# EasyEDA Pro project ProPrj_2026_05_12_drone_2026-05-23.epro

# Schematic Schematic1
Board Name: Board1; Create Date: 2026-05-12; Page Name: P1; Project Name: 2026_05_12_drone; Schematic Name: Schematic1; Update Date: 2026-05-12; Company: EasyEDA.com; Page Size: A4; Version: V1.0
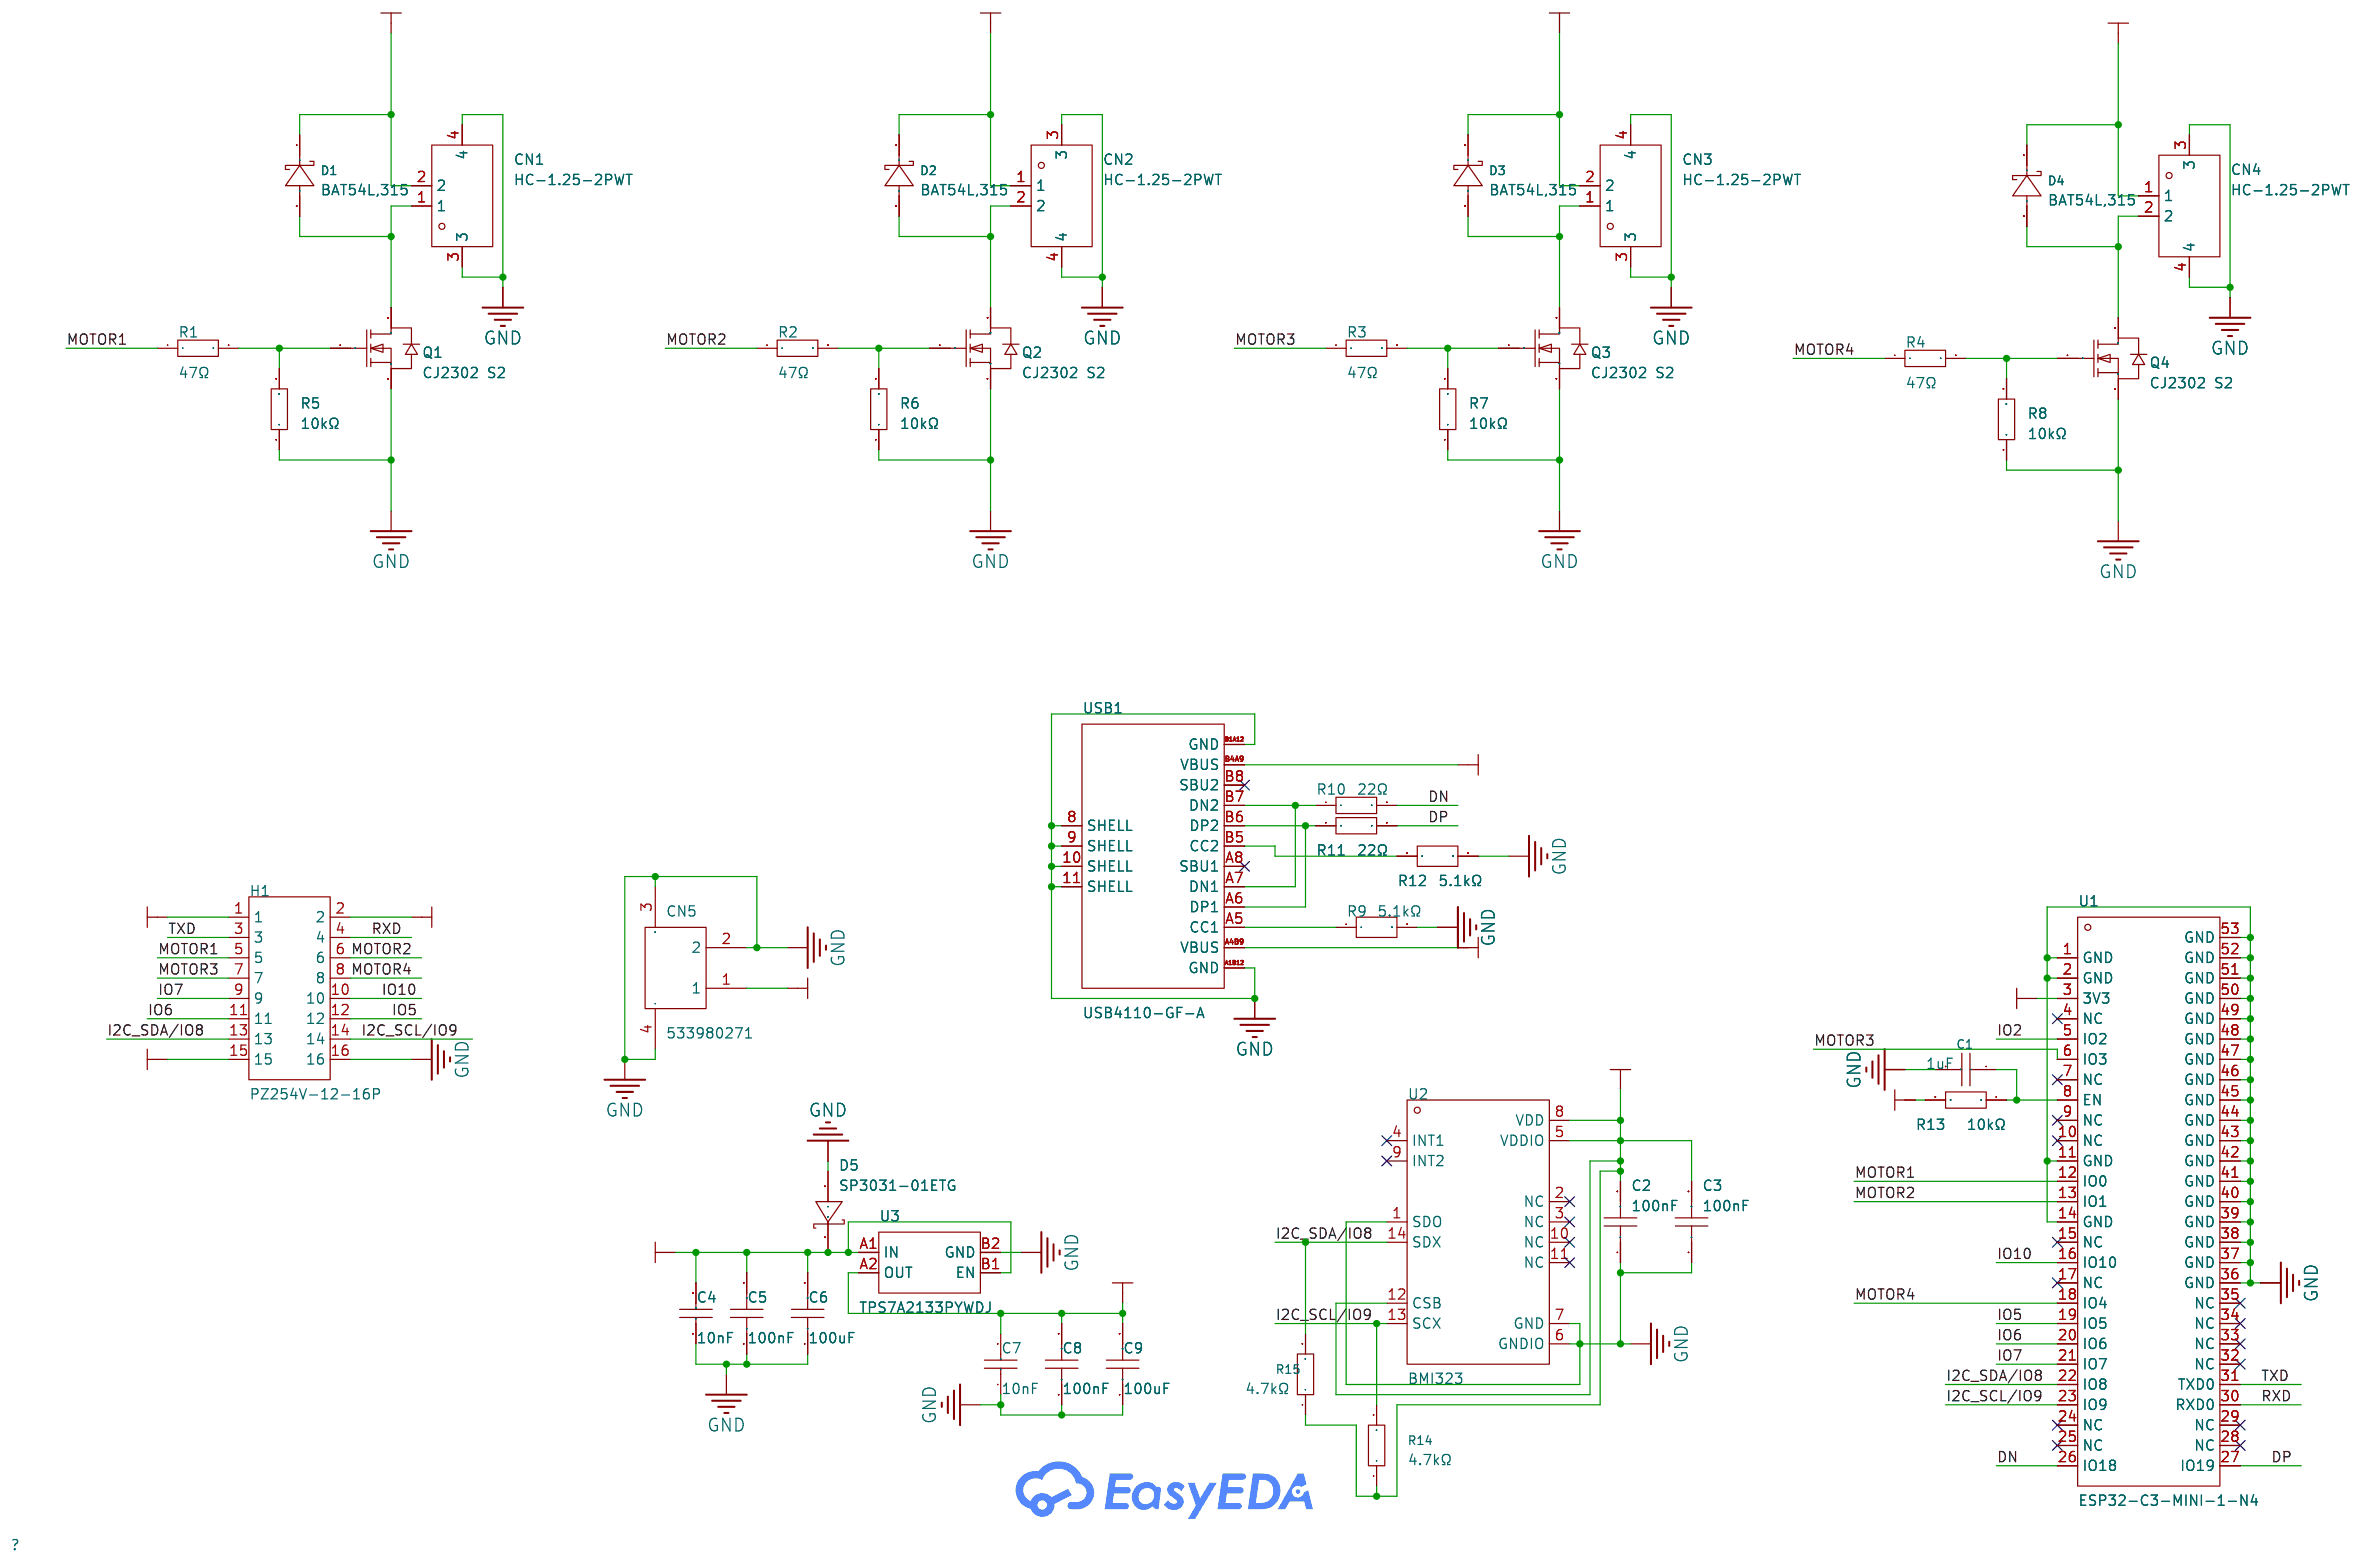
[diagram p0: schematic sheet]

## Parts
C1  1uF  [C0402]
C2  100nF  [C0402]
C3  100nF  [C0402]
C4  10nF  [C0402]
C5  100nF  [C0603]
C6  100uF  [C1206]
C7  10nF  [C0402]
C8  100nF  [C0603]
C9  100uF  [C1206]
CN1  HC-1.25-2PWT  [CONN-SMD_2P-P1.25-HC-1.25-2PWT]
CN2  HC-1.25-2PWT  [CONN-SMD_2P-P1.25-HC-1.25-2PWT]
CN3  HC-1.25-2PWT  [CONN-SMD_2P-P1.25-HC-1.25-2PWT]
CN4  HC-1.25-2PWT  [CONN-SMD_2P-P1.25-HC-1.25-2PWT]
CN5  533980271  [CONN-SMD_2P-P1.25_053398-0X71]
D1  BAT54L,315  [DFN1006-2L-RD]
D2  BAT54L,315  [DFN1006-2L-RD]
D3  BAT54L,315  [DFN1006-2L-RD]
D4  BAT54L,315  [DFN1006-2L-RD]
D5  SP3031-01ETG  [SOD-882_L1.0-W0.6-RD]
H1  PZ254V-12-16P  [HDR-TH_16P-P2.54-V-M-R2-C8-S2.54]
Q1  CJ2302 S2  [SOT-23-3_L3.0-W1.7-P0.95-LS2.9-BR]
Q2  CJ2302 S2  [SOT-23-3_L3.0-W1.7-P0.95-LS2.9-BR]
Q3  CJ2302 S2  [SOT-23-3_L3.0-W1.7-P0.95-LS2.9-BR]
Q4  CJ2302 S2  [SOT-23-3_L3.0-W1.7-P0.95-LS2.9-BR]
R1  47Ω  [R0402]
R2  47Ω  [R0402]
R3  47Ω  [R0402]
R4  47Ω  [R0402]
R5  10kΩ  [R0402]
R6  10kΩ  [R0402]
R7  10kΩ  [R0402]
R8  10kΩ  [R0402]
R9  5.1kΩ  [R0603]
R10  22Ω  [R0603]
R11  22Ω  [R0603]
R12  5.1kΩ  [R0603]
R13  10kΩ  [R0603]
R14  4.7kΩ  [R0402]
R15  4.7kΩ  [R0402]
U1  ESP32-C3-MINI-1-N4  [WIFIM-SMD_ESP32-C3-MINI-1]
U2  BMI323  [LGA-14_L3.0-W2.5-P0.50-TL_QMI8658A]
U3  TPS7A2133PYWDJ  [DSBGA-4_L0.6-W0.6-P0.35-TL]
USB1  USB4110-GF-A  [USB-C-SMD_TYPE-C-16P-USB4110-GF-A]

## Library data of the parts
C1 = CL05A105KO5NNNC: Capacitance:1uF Tolerance:±10% Tolerance:±10% Voltage Rating:16V Temperature Coefficient:X5R; LCSC Part Name: 1uF ±10% 16V; Supplier Part: C29266; Manufacturer: SAMSUNG(三星); Supplier Footprint: 0402; JLCPCB Part Class: Extended Part; Datasheet: https://item.szlcsc.com/datasheet/CL05A105KO5NNNC/30018.html; Supplier: LCSC; Tolerance: ±10%; Voltage Rating: 16V; Temperature Coefficient: X5R
C2 C3 = CL05B104KO5NNNC: Capacitance: Tolerance:±10% Tolerance:±10% Voltage Rated: Temperature Coefficient:; LCSC Part Name: 100nF ±10% 16V; Supplier Part: C1525; Manufacturer: SAMSUNG(三星); Supplier Footprint: 0402; JLCPCB Part Class: Basic Part; Datasheet: https://atta.szlcsc.com/upload/public/pdf/source/20160218/1457707763339.pdf; Supplier: LCSC; Tolerance: ±10%
C4 C7 = CL05B103KB5NNNC: Capacitance:10nF Tolerance:±10% Tolerance:±10% Voltage Rating:50V Temperature Coefficient:X7R; LCSC Part Name: 10nF ±10% 50V; Supplier Part: C15195; Manufacturer: SAMSUNG(三星); Supplier Footprint: 0402; JLCPCB Part Class: Basic Part; Datasheet: https://item.szlcsc.com/datasheet/CL05B103KB5NNNC/15869.html; Supplier: LCSC; Tolerance: ±10%; Voltage Rating: 50V; Temperature Coefficient: X7R
C5 C8 = CC0603KRX7R9BB104: Capacitance:100nF Tolerance:±10% Tolerance:±10% Voltage Rating:50V Temperature Coefficient:X7R; LCSC Part Name: 100nF ±10% 50V; Supplier Part: C14663; Manufacturer: YAGEO(国巨); Supplier Footprint: 0603; Datasheet: https://item.szlcsc.com/datasheet/CC0603KRX7R9BB104/15331.html; Supplier: LCSC; Tolerance: ±10%; Voltage Rating: 50V; Temperature Coefficient: X7R
C6 C9 = HGC1206R5107M100NSPJ: Capacitance:100uF Tolerance:±20% Tolerance:±20% Voltage Rating:10V Temperature Coefficient:X5R; LCSC Part Name: 100uF ±20% 10V; Supplier Part: C7432784; Manufacturer: Chinocera(华瓷); Supplier Footprint: 1206; JLCPCB Part Class: Extended Part; Datasheet: https://atta.szlcsc.com/upload/public/pdf/source/20240320/FAC3FEC40A78BC5CCCE96C232A94D860.pdf; Supplier: LCSC; Tolerance: ±20%; Voltage Rating: 10V; Temperature Coefficient: X5R
CN1-CN4 = HC-1.25-2PWT: Pins Structure:1x2P Pitch:1.25mm Mounting Style:Horizontal attachment Reference Series:PicoBlade(MX 1.25) Number of Pins:2P Number of Rows:1 Number of PINs Per Row:2 Row Spacing:- Current Rating (Max):1A Contact Material:Brass Contact Plating:Tin Operatin; LCSC Part Name: 1x2P 间距:1.25mm 卧贴 系列:PicoBlade(MX 1.25); Supplier Part: C2845379; Manufacturer: HCTL(华灿天禄); Supplier Footprint: SMD,P=1.25mm,卧贴; JLCPCB Part Class: Extended Part; Datasheet: https://atta.szlcsc.com/upload/public/pdf/source/20240930/9508A8292CCC87B0C29E3A028D56E30A.pdf; Supplier: LCSC; Pins Structure: 1x2P; Pitch: 1.25mm; Mounting Style: Horizontal attachment; Reference Series: PicoBlade(MX 1.25); Number of Pins: 2P; Number of Rows: 1; Number of PINs Per Row: 2; Current Rating (Max): 1A; Contact Material: Brass; Contact Plating: Tin; Operating Temperature Range: -40℃~+105℃; Rated Voltage (Max): 125V; Plastic Material: LCP; Flame Retardant Rating: UL94V-0; Supplementary Features: Auxiliary soldering legs; Z-Height of the Board: 3.57mm; X-Length of Bottom Edge on Board (Spacing Line): 7.55mm; Y-Width of Bottom Edge on Board: 5.25mm
CN5 = 533980271_C122410: Pins Structure:1x2P Pitch:1.25mm Mounting Type:Surface Mount,Vertical Reference Series:PicoBlade(MX 1.25) Number of Pins:2P Number of Rows:1 Number of PINs Per Row:2 Row Spacing:- Current Rating:1A Contact Material:Phosphor Bronze Contact Plating:Tin Oper; LCSC Part Name: 1x2P 间距:1.25mm 立贴 系列:PicoBlade(MX 1.25); Supplier Part: C122410; Manufacturer: MOLEX; Supplier Footprint: SMD,P=1.25mm; JLCPCB Part Class: Extended Part; Datasheet: https://www.molex.com/content/dam/molex/molex-dot-com/products/automated/en-us/salesdrawingpdf/533/53398/533980271_sd.pdf?inline; Supplier: LCSC; Pins Structure: 1x2P; Pitch: 1.25mm; Mounting Type: Surface Mount,Vertical; Reference Series: PicoBlade(MX 1.25); Number of Pins: 2P; Number of Rows: 1; Number of PINs Per Row: 2; Current Rating: 1A; Contact Material: Phosphor Bronze; Contact Plating: Tin; Operating Temperature: -40℃~+105℃; Voltage Rating: 125V; Plastic Material: Glass-Fiber Reinforced PA; Flame Retardant Rating: UL94V-0; Supplementary Features: Auxiliary Solder Pin; Color: White; Z-Height of the Board: 4.7mm; X-Length of Bottom Edge on Board (Spacing Line): 7.65mm; Y-Width of Bottom Edge on Board: 4.2mm
D1-D4 = BAT54L,315: Voltage - Forward(Vf@If):800mV@100mA Voltage - DC Reverse(Vr):30V Current - Rectified:200mA Reverse Leakage Current (Ir):2uA@25V Non-Repetitive Peak Forward Surge Current:600mA; LCSC Part Name: 电压:30V 电流:200mA; Supplier Part: C549279; Manufacturer: Nexperia(安世); Supplier Footprint: DFN1006-2; JLCPCB Part Class: Extended Part; Datasheet: https://item.szlcsc.com/datasheet/BAT54L%252C315/570347.html; Supplier: LCSC; Voltage - Forward(Vf@If): 800mV@100mA; Voltage - DC Reverse(Vr): 30V; Current - Rectified: 200mA; Reverse Leakage Current (Ir): 2uA@25V; Non-Repetitive Peak Forward Surge Current: 600mA
D5 = SP3031-01ETG: Polarity:Unidirectional Reverse Stand-Off Voltage (Vrwm):5V Clamping Voltage:7.5V Peak Pulse Current (Ipp):5A@8/20us Peak Pulse Power Dissipation (Ppp):- Voltage - Breakdown:6V Reverse Leakage Current (Ir):1uA Number of Channels:1.0 level of protection:IE; Supplier Part: C207283; Manufacturer: Littelfuse(美国力特); Supplier Footprint: SOD-882; JLCPCB Part Class: Extended Part; Datasheet: https://item.szlcsc.com/datasheet/SP3031-01ETG/208402.html; Supplier: LCSC; Polarity: Unidirectional; Reverse Stand-Off Voltage (Vrwm): 5V; Clamping Voltage: 7.5V; Peak Pulse Current (Ipp): 5A@8/20us; Voltage - Breakdown: 6V; Reverse Leakage Current (Ir): 1uA; Number of Channels: 1.0; level of protection: IEC 61000-4-4；IEC 61000-4-5；IEC 61000-4-2; Type: TVS; Junction Capacitance: 0.8pF
H1 = PZ254V-12-16P: Pin Structure:2x8P Pitch:2.54mm Row Spacing:2.54mm Circluar Pins/Square Pins:Pin Header Mounting Type:Through Hole Number of Rows:2 Number of Pins:16P Current Rating:- Voltage Rating (Max):- Length of Mating Pin:6mm Insulation Height:2.5mm Length of End C; LCSC Part Name: 2x8P 间距:2.54mm 方针 直插; Supplier Part: C492425; Manufacturer: XFCN(兴飞); Supplier Footprint: 插件,P=2.54mm; JLCPCB Part Class: Extended Part; Datasheet: https://item.szlcsc.com/datasheet/PZ254V-12-16P/502981.html; Supplier: LCSC; Pin Structure: 2x8P; Pitch: 2.54mm; Row Spacing: 2.54mm; Circluar Pins/Square Pins: Pin Header; Mounting Type: Through Hole; Number of Rows: 2; Number of Pins: 16P; Length of Mating Pin: 6mm; Insulation Height: 2.5mm; Length of End Connection Pin: 3mm; Contact Material: Brass; Operating Temperature: -40℃~+105℃; Color: Black
Q1-Q4 = CJ2302 S2: Type:1 N-Channel Drain Source Voltage (Vdss): Continuous Drain Current (Id): Drain Source On Resistance (RDS(on)@Vgs,Id):0.115Ω@2.5V,3.1A Power Dissipation (Pd):350mW Gate Threshold Voltage (Vgs(th)@Id):1.2V@50uA Total Gate Charge (Qg@Vgs):10nC@4.5V Input; LCSC Part Name: 1个N沟道 耐压:20V 电流:2.1A; Supplier Part: C8548; Manufacturer: CJ(江苏长电/长晶); Supplier Footprint: SOT-23; JLCPCB Part Class: Extended Part; Datasheet: https://atta.szlcsc.com/upload/public/pdf/source/20130613/1457706609595.pdf; Supplier: LCSC; Type: 1 N-Channel; Drain Source On Resistance (RDS(on)@Vgs,Id): 0.115Ω@2.5V,3.1A; Power Dissipation (Pd): 350mW; Gate Threshold Voltage (Vgs(th)@Id): 1.2V@50uA; Total Gate Charge (Qg@Vgs): 10nC@4.5V; Input Capacitance (Ciss@Vds): 300pF@10V; Reverse Transfer Capacitance (Crss@Vds): 80pF@10V; Operating Temperature: -55℃~+150℃
R1-R4 = RC0402FR-0747RL: Type:Thick Film Resistor Resistance:47Ω Tolerance:±1% Tolerance:±1% Power(Watts):62.5mW Voltage-Supply(Max):50V Temperature Coefficient:±100ppm/℃ Temperature Coefficient:±100ppm/℃ Operating Temperature:-55℃~+155℃ Operating Temperature:-55℃~+155℃; LCSC Part Name: 厚膜电阻 47Ω ±1% 62.5mW; Supplier Part: C137973; Manufacturer: YAGEO(国巨); Supplier Footprint: 0402; Datasheet: https://item.szlcsc.com/datasheet/RC0402FR-0747RL/149289.html; Supplier: LCSC; Type: Thick Film Resistor; Tolerance: ±1%; Power(Watts): 62.5mW; Voltage-Supply(Max): 50V; Temperature Coefficient: ±100ppm/℃; Operating Temperature: -55℃~+155℃
R5-R8 = RC0402FR-0710KL: Type:Thick Film Resistor Resistance:10kΩ Tolerance:±1% Tolerance:±1% Power(Watts):62.5mW Voltage-Supply(Max):50V Temperature Coefficient:±100ppm/℃ Temperature Coefficient:±100ppm/℃ Operating Temperature:-55℃~+155℃ Operating Temperature:-55℃~+155℃; LCSC Part Name: 厚膜电阻 10kΩ ±1% 62.5mW; Supplier Part: C60490; Manufacturer: YAGEO(国巨); Supplier Footprint: 0402; Datasheet: https://item.szlcsc.com/datasheet/RC0402FR-0710KL/61542.html; Supplier: LCSC; Type: Thick Film Resistor; Tolerance: ±1%; Power(Watts): 62.5mW; Voltage-Supply(Max): 50V; Temperature Coefficient: ±100ppm/℃; Operating Temperature: -55℃~+155℃
R9 R12 = FRC0603F5101TS: Type:Thick Film Resistor Resistance:5.1kΩ Tolerance:±1% Tolerance:±1% Power(Watts):100mW Voltage-Supply(Max):75V Temperature Coefficient:±100ppm/℃ Temperature Coefficient:±100ppm/℃ Operating Temperature:-55℃~+155℃ Operating Temperature:-55℃~+155℃; LCSC Part Name: 5.1kΩ ±1% 100mW 厚膜电阻; Supplier Part: C2907044; Manufacturer: FOJAN(富捷); Supplier Footprint: 0603; JLCPCB Part Class: Extended Part; Supplier: LCSC; Type: Thick Film Resistor; Tolerance: ±1%; Power(Watts): 100mW; Voltage-Supply(Max): 75V; Temperature Coefficient: ±100ppm/℃; Operating Temperature: -55℃~+155℃
R10 R11 = 0603WAF220JT5E: Type:Thick Film Resistors Resistance:22Ω Tolerance:±1% Tolerance:±1% Power(Watts): Overload Voltage (Max): Temperature Coefficient:±100ppm/℃ Temperature Coefficient:±100ppm/℃ Operating Temperature Range:-55℃~+155℃ Operating Temperature Range:-55℃~+155℃; LCSC Part Name: 22Ω ±1% 100mW 厚膜电阻; Supplier Part: C23345; Manufacturer: UNI-ROYAL(厚声); Supplier Footprint: 0603; JLCPCB Part Class: Basic Part; Datasheet: https://atta.szlcsc.com/upload/public/pdf/source/20200306/C422600_1E6D84923E4A46A82E41ADD87F860B5C.pdf; Supplier: LCSC; Type: Thick Film Resistors; Tolerance: ±1%; Temperature Coefficient: ±100ppm/℃; Operating Temperature Range: -55℃~+155℃
R13 = RC0603FR-0710KL: Type:Thick Film Resistors Resistance: Tolerance:±1% Tolerance:±1% Power(Watts): Overload Voltage (Max): Temperature Coefficient:±100ppm/℃ Temperature Coefficient:±100ppm/℃ Operating Temperature Range:-55℃~+155℃ Operating Temperature Range:-55℃~+155℃; LCSC Part Name: 厚膜电阻 10kΩ ±1% 100mW; Supplier Part: C98220; Manufacturer: YAGEO(国巨); Supplier Footprint: 0603; JLCPCB Part Class: Extended Part; Datasheet: https://atta.szlcsc.com/upload/public/pdf/source/20180927/C295883_E8D83085EA81BD7DE0B2B681138C15EE.pdf; Supplier: LCSC; Type: Thick Film Resistors; Tolerance: ±1%; Temperature Coefficient: ±100ppm/℃; Operating Temperature Range: -55℃~+155℃
R14 R15 = 0402WGF4701TCE: Type:Thick Film Resistor Resistance:4.7kΩ Tolerance:±1% Tolerance:±1% Power(Watts):62.5mW Voltage-Supply(Max):50V Temperature Coefficient:±100ppm/℃ Temperature Coefficient:±100ppm/℃ Operating Temperature:-55℃~+155℃ Operating Temperature:-55℃~+155℃; LCSC Part Name: 4.7kΩ ±1% 62.5mW 厚膜电阻; Supplier Part: C25900; Manufacturer: UNI-ROYAL(厚声); Supplier Footprint: 0402; JLCPCB Part Class: Basic Part; Datasheet: https://item.szlcsc.com/datasheet/0402WGF4701TCE/26643.html; Supplier: LCSC; Type: Thick Film Resistor; Tolerance: ±1%; Power(Watts): 62.5mW; Voltage-Supply(Max): 50V; Temperature Coefficient: ±100ppm/℃; Operating Temperature: -55℃~+155℃
U1 = ESP32-C3-MINI-1-N4: Supplier Part: C2838502; Manufacturer: ESPRESSIF(乐鑫); Supplier Footprint: SMD,13.2x16.6mm; JLCPCB Part Class: Extended Part; Datasheet: https://item.szlcsc.com/datasheet/ESP32-C3-MINI-1-N4/3013227.html; Supplier: LCSC
U2 = BMI323: Sensor Type:Accelerometer Gyroscope Operating Temperature:-40℃~+85℃ Operating Temperature:-40℃~+85℃; LCSC Part Name: 小型多功能惯性测量单元; Supplier Part: C5368700; Manufacturer: Bosch(博世); Supplier Footprint: LGA-14; JLCPCB Part Class: Extended Part; Datasheet: https://item.szlcsc.com/datasheet/BMI323/6208337.html; Supplier: LCSC; Sensor Type: Accelerometer Gyroscope; Operating Temperature: -40℃~+85℃
U3 = TPS7A2133PYWDJ: Output Type:Fixed Maximum Input Voltage:6V Output Voltage:3.3V Output Voltage:3.3V Output Current:500mA Power Supply Rejection Ratio (PSRR):61dB@(100Hz) Operating Temperature:-40℃~+125℃@(Tj) Operating Temperature:-40℃~+125℃@(Tj) Output Polarity:Positive e; LCSC Part Name: 500mA 低噪声、低 IQ、高 PSRR 低压降 (LDO) 稳压器; Supplier Part: C3019997; Manufacturer: TI(德州仪器); Supplier Footprint: DSBGA-4; JLCPCB Part Class: Extended Part; Datasheet: https://www.ti.com/cn/lit/gpn/tps7a21; Supplier: LCSC; Output Type: Fixed; Maximum Input Voltage: 6V; Output Voltage: 3.3V; Output Current: 500mA; Power Supply Rejection Ratio (PSRR): 61dB@(100Hz); Operating Temperature: -40℃~+125℃@(Tj); Output Polarity: Positive electrode; Number of Outputs: 1
USB1 = USB4110-GF-A: Supplier Part: C5143397; Manufacturer: GCT; Supplier Footprint: SMD; JLCPCB Part Class: Extended Part; Datasheet: https://item.szlcsc.com/datasheet/USB4110-GF-A/5762033.html; Supplier: LCSC

## Nets
3V3: C2.2 C3.2 C7.2 C8.2 C9.2 H1.15 R13.2 R14.1 R15.1 U1.3(3V3) U2.5(VDDIO) U2.8(VDD) U2.12(CSB) U3.A2(OUT)
GND: C1.2 C2.1 C3.1 C4.1 C5.1 C6.1 C7.1 C8.1 C9.1 CN1.3 CN1.4 CN2.3 CN2.4 CN3.3 CN3.4 CN4.3 CN4.4 CN5.2 CN5.3 CN5.4 D5.2(A) H1.16 Q1.2(S) Q2.2(S) Q3.2(S) Q4.2(S) R5.1 R6.1 R7.1 R8.1 R9.2 R12.2 U1.1(GND) U1.2(GND) U1.11(GND) U1.14(GND) U1.36(GND) U1.37(GND) U1.38(GND) U1.39(GND) U1.40(GND) U1.41(GND) U1.42(GND) U1.43(GND) U1.44(GND) U1.45(GND) U1.46(GND) U1.47(GND) U1.48(GND) U1.49(GND) U1.50(GND) U1.51(GND) U1.52(GND) U1.53(GND) U2.1(SDO) U2.6(GNDIO) U2.7(GND) U3.B2(GND) USB1.8(SHELL) USB1.9(SHELL) USB1.10(SHELL) USB1.11(SHELL) USB1.A1B12(GND) USB1.B1A12(GND)
VBAT: CN1.2 CN2.1 CN3.2 CN4.1 CN5.1 D1.1(K) D2.1(K) D3.1(K) D4.1(K) H1.1
VCC: C4.2 C5.2 C6.2 D5.1(K) H1.2 U3.A1(IN) U3.B1(EN) USB1.A4B9(VBUS) USB1.B4A9(VBUS)
DN: R10.2 U1.26(IO18)
DP: R11.2 U1.27(IO19)
I2C_SCL/IO9: H1.14 R14.2 U1.23(IO9) U2.13(SCX)
I2C_SDA/IO8: H1.13 R15.2 U1.22(IO8) U2.14(SDX)
IO2: U1.5(IO2)
IO5: H1.12 U1.19(IO5)
IO6: H1.11 U1.20(IO6)
IO7: H1.9 U1.21(IO7)
IO10: H1.10 U1.16(IO10)
MOTOR1: H1.5 R1.1 U1.12(IO0)
MOTOR2: H1.6 R2.1 U1.13(IO1)
MOTOR3: H1.7 R3.1 U1.6(IO3)
MOTOR4: H1.8 R4.1 U1.18(IO4)
RXD: H1.4 U1.30(RXD0)
TXD: H1.3 U1.31(TXD0)
$1N2473: Q1.1(G) R1.2 R5.2
$1N2475: CN1.1 D1.2(A) Q1.3(D)
$1N2480: Q2.1(G) R2.2 R6.2
$1N2482: CN2.2 D2.2(A) Q2.3(D)
$1N2487: Q3.1(G) R3.2 R7.2
$1N2489: CN3.1 D3.2(A) Q3.3(D)
$1N2494: Q4.1(G) R4.2 R8.2
$1N2496: CN4.2 D4.2(A) Q4.3(D)
$1N2513: R9.1 USB1.A5(CC1)
$1N2515: R10.1 USB1.A7(DN1) USB1.B7(DN2)
$1N2516: R11.1 USB1.A6(DP1) USB1.B6(DP2)
$1N2522: R12.1 USB1.B5(CC2)
$1N2536: C1.1 R13.1 U1.8(EN)

Not connected (* = marked no-connect by the designer): U1 4(NC)* 7(NC)* 9(NC)* 10(NC)* 15(NC)* 17(NC)* 24(NC)* 25(NC)* 28(NC)* 29(NC)* 32(NC)* 33(NC)* 34(NC)* 35(NC)*; U2 2(NC)* 3(NC)* 4(INT1)* 9(INT2)* 10(NC)* 11(NC)*; USB1 A8(SBU1)* B8(SBU2)*

# Board PCB1
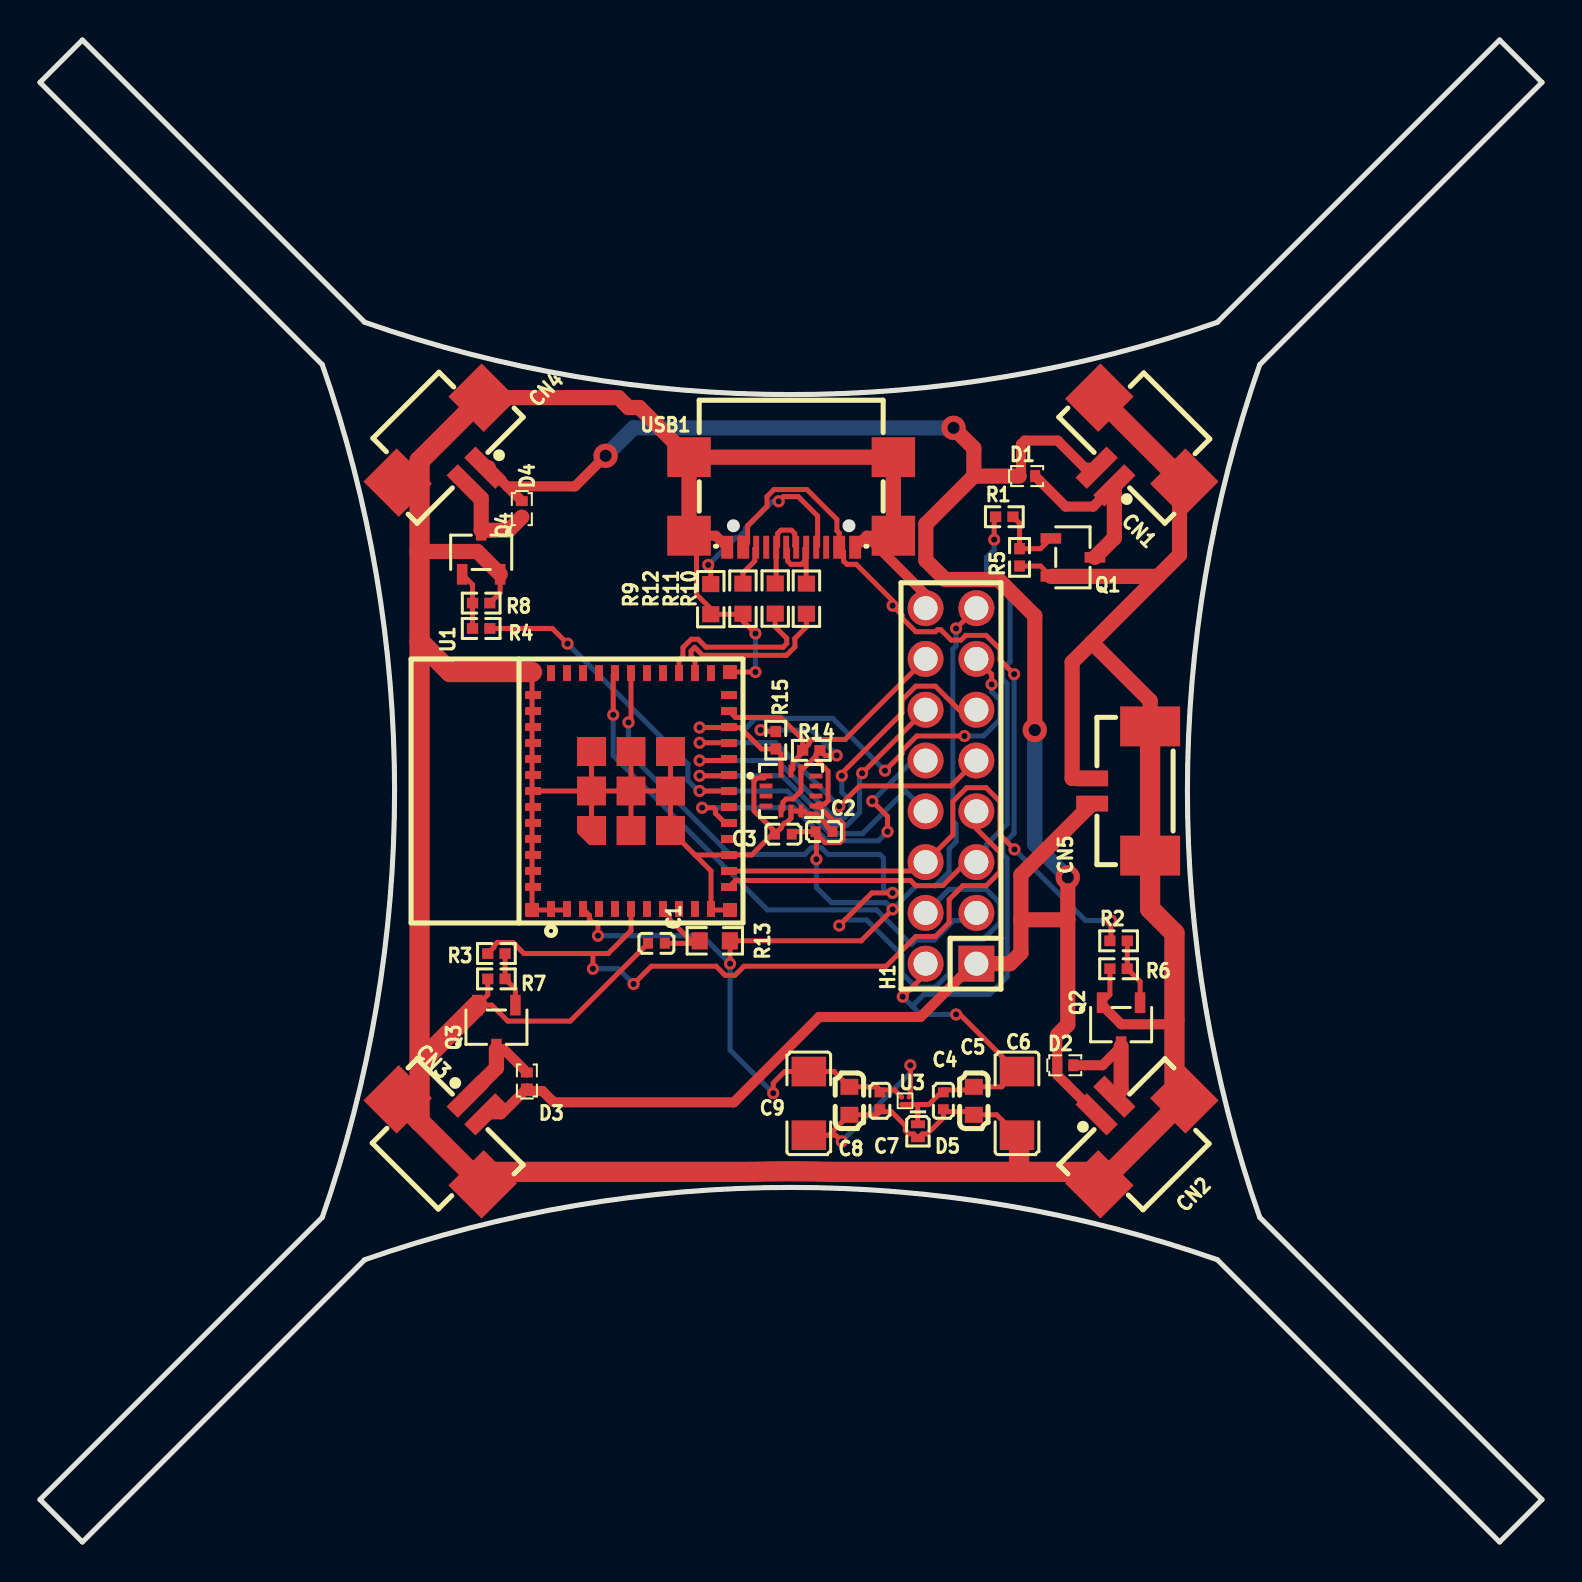
[diagram p1: board, top side]
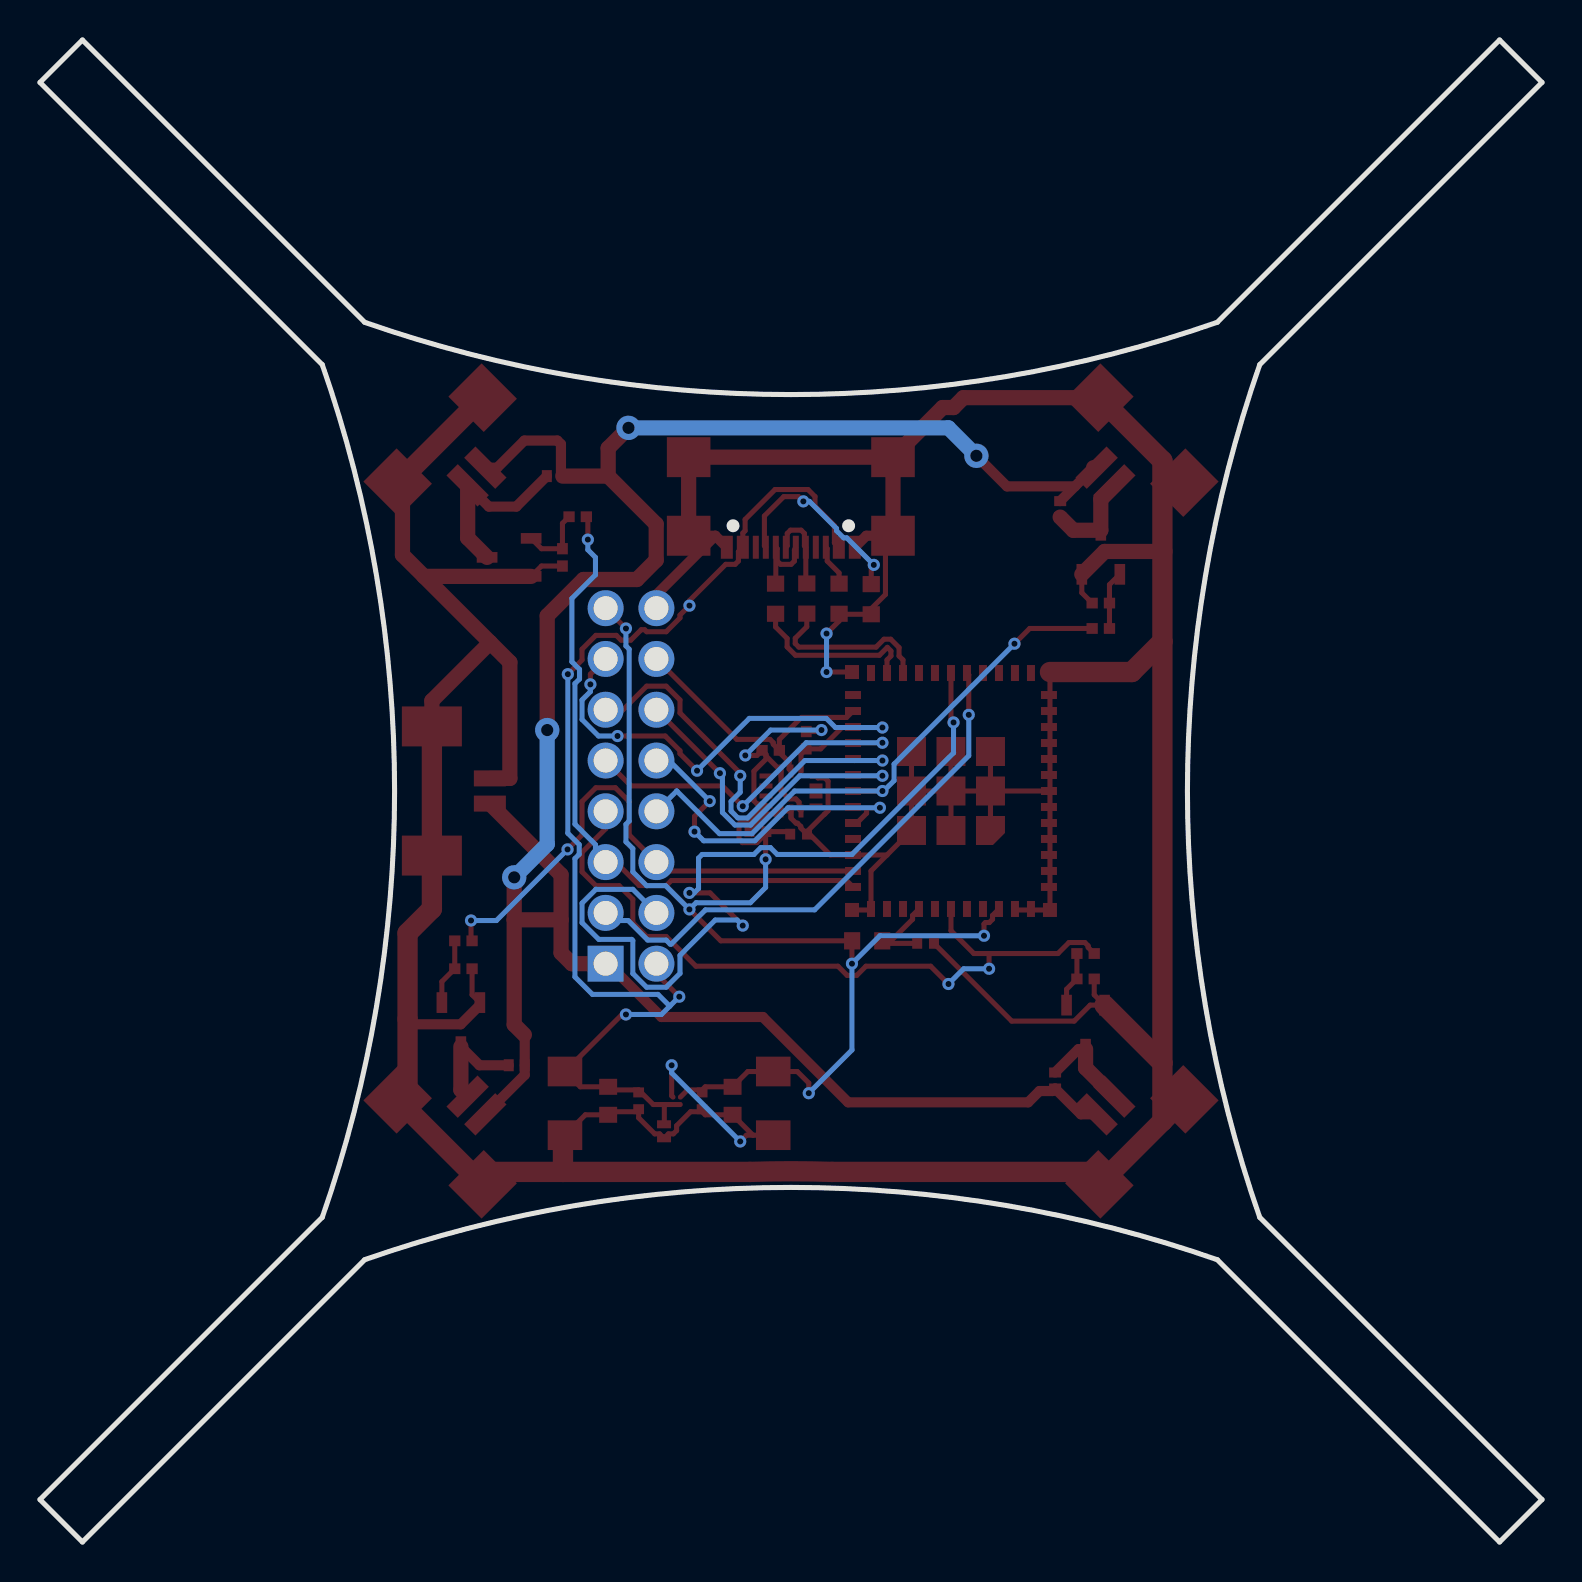
[diagram p2: board, bottom side, seen from below]

Outline 75.12 x 75.12 mm; copper layers: Top Layer, Bottom Layer. Coordinates in mm from the lower left corner of the outline.
Outline path: 0,73 2.12,75.12 16.24,61 arc(37.56,57.38) 58.88,61 73,75.12 75.12,73 61,58.88 arc(57.38,37.56) 61,16.24 75.12,2.12 73,0 58.88,14.12 arc(37.56,17.73) 16.24,14.12 2.12,0 0,2.12 14.12,16.24 arc(17.73,37.56) 14.12,58.88 0,73
Stack: Top Layer 0.035mm / Dielectric1 1.51mm FR4 er 4.5 / Bottom Layer 0.035mm

## Design rules (mm)
net DP: DP1
net DN: DP1
net $1N2515: DP2
net $1N2516: DP2
template: JLCPCB Capability(Two Layers Board)
spacing copperThickness1oz (default): track to track 0.102, other pairs 0.152 to 0.3
spacing copperThickness2oz: track to track 0.203, other pairs 0.152 to 0.3
track width copperThickness1oz (default): min 0.127, default 0.254, max 2.54
track width copperThickness2oz: min 0.203, default 0.254, max 2.54
differential pair differentialPair (default): width min 0.127, default 0.254, max 2.54; gap min 0.152, default 0.152
via viaSize (default): diameter min 0.5, default 0.61, max 10; hole min 0.3, default 0.305, max 6.3

## Placement (name value [footprint] x y rotation side)
C1  1uF  [C0402]  30.83 29.94 180 top
C2  100nF  [C0402]  39.21 35.53 180 top
C3  100nF  [C0402]  37.18 35.4 0 top
C4  10nF  [C0402]  45.18 22.06 90 top
C5  100nF  [C0603]  46.7 22.06 90 top
C6  100uF  [C1206]  48.86 21.94 90 top
C7  10nF  [C0402]  42 22.06 90 top
C8  100nF  [C0603]  40.48 22.06 90 top
C9  100uF  [C1206]  38.45 21.94 90 top
CN1  HC-1.25-2PWT  [CONN-SMD_2P-P1.25-HC-1.25-2PWT]  54.2 54.2 135 top
CN2  HC-1.25-2PWT  [CONN-SMD_2P-P1.25-HC-1.25-2PWT]  54.2 20.92 45 top
CN3  HC-1.25-2PWT  [CONN-SMD_2P-P1.25-HC-1.25-2PWT]  20.92 20.92 315 top
CN4  HC-1.25-2PWT  [CONN-SMD_2P-P1.25-HC-1.25-2PWT]  20.92 54.2 225 top
CN5  533980271  [CONN-SMD_2P-P1.25_053398-0X71]  54.07 37.56 90 top
D1  BAT54L,315  [DFN1006-2L-RD]  49.37 53.31 0 top
D2  BAT54L,315  [DFN1006-2L-RD]  51.28 23.84 0 top
D3  BAT54L,315  [DFN1006-2L-RD]  24.35 23.08 90 top
D4  BAT54L,315  [DFN1006-2L-RD]  24.1 51.66 270 top
D5  SP3031-01ETG  [SOD-882_L1.0-W0.6-RD]  43.91 20.54 270 top
H1  PZ254V-12-16P  [HDR-TH_16P-P2.54-V-M-R2-C8-S2.54]  45.56 37.81 90 top
Q1  CJ2302 S2  [SOT-23-3_L3.0-W1.7-P0.95-LS2.9-BR]  51.66 49.24 180 top
Q2  CJ2302 S2  [SOT-23-3_L3.0-W1.7-P0.95-LS2.9-BR]  54.07 25.88 90 top
Q3  CJ2302 S2  [SOT-23-3_L3.0-W1.7-P0.95-LS2.9-BR]  22.83 25.75 90 top
Q4  CJ2302 S2  [SOT-23-3_L3.0-W1.7-P0.95-LS2.9-BR]  22.06 49.5 270 top
R1  47Ω  [R0402]  48.23 51.27 0 top
R2  47Ω  [R0402]  53.94 30.07 0 top
R3  47Ω  [R0402]  22.83 29.43 0 top
R4  47Ω  [R0402]  22.06 45.69 180 top
R5  10kΩ  [R0402]  48.99 49.24 90 top
R6  10kΩ  [R0402]  53.94 28.67 0 top
R7  10kΩ  [R0402]  22.83 28.16 0 top
R8  10kΩ  [R0402]  22.06 46.96 180 top
R9  5.1kΩ  [R0603]  33.55 47.15 270 top
R10  22Ω  [R0603]  38.33 47.18 270 top
R11  22Ω  [R0603]  36.77 47.18 270 top
R12  5.1kΩ  [R0603]  35.16 47.18 270 top
R13  10kΩ  [R0603]  33.75 30.07 0 top
R14  4.7kΩ  [R0402]  38.57 39.59 180 top
R15  4.7kΩ  [R0402]  36.8 40.1 270 top
U1  ESP32-C3-MINI-1-N4  [WIFIM-SMD_ESP32-C3-MINI-1]  29.56 37.56 90 top
U2  BMI323  [LGA-14_L3.0-W2.5-P0.50-TL_QMI8658A]  37.56 37.56 0 top
U3  TPS7A2133PYWDJ  [DSBGA-4_L0.6-W0.6-P0.35-TL]  43.27 22.06 90 top
USB1  USB4110-GF-A  [USB-C-SMD_TYPE-C-16P-USB4110-GF-A]  37.57 52 180 top

## Footprints (pads in the part's own frame, mm; a bottom-side part is the same pattern mirrored in y, then rotated)
C0402
  rect 0.5x0.54 smd: 1(-0.42,0) 2(0.42,0)
C0603
  rect 0.8x0.9 smd: 1(-0.7,0) 2(0.7,0)
C1206
  rect 1.485x1.728 smd: 1(-1.593,0) 2(1.593,0)
CONN-SMD_2P-P1.25-HC-1.25-2PWT
  rect 0.8x2.2 smd: 1(-0.625,1.285) 2(0.625,1.285)
  rect 2.35x2.5 smd: 3(-3.005,-1.285) 4(3.005,-1.285)
CONN-SMD_2P-P1.25_053398-0X71
  rect 0.8x1.6 smd: 1(-0.63,1.45) 2(0.63,1.45)
  rect 2x3 smd: 3(3.229,-1.45) 4(-3.229,-1.45)
DFN1006-2L-RD
  rect 0.5x0.6 smd: 1(-0.4,0) 2(0.4,0)
DSBGA-4_L0.6-W0.6-P0.35-TL
  rect 0.165x0.165 smd: A1(-0.175,0.175) A2(0.175,0.175) B1(-0.175,-0.175) B2(0.175,-0.175)
HDR-TH_16P-P2.54-V-M-R2-C8-S2.54
  rect 1.8x1.8 hole 1.2: 1(-8.89,-1.27)
  round 1.8 hole 1.2: 2(-8.89,1.27) 3(-6.35,-1.27) 4(-6.35,1.27) 5(-3.81,-1.27) 6(-3.81,1.27) 7(-1.27,-1.27) 8(-1.27,1.27) 9(1.27,-1.27) 10(1.27,1.27) 11(3.81,-1.27) 12(3.81,1.27) 13(6.35,-1.27) 14(6.35,1.27) 15(8.89,-1.27) 16(8.89,1.27)
LGA-14_L3.0-W2.5-P0.50-TL_QMI8658A
  rect 0.65x0.25 smd: 1(-1.25,0.75) 2(-1.25,0.25) 3(-1.25,-0.25) 4(-1.25,-0.75) 8(1.25,-0.75) 9(1.25,-0.25) 10(1.25,0.25) 11(1.25,0.75)
  rect 0.25x0.65 smd: 5(-0.5,-1) 6(0,-1) 7(0.5,-1) 12(0.5,1) 13(0,1) 14(-0.5,1)
R0402
  rect 0.566x0.54 smd: 1(-0.433,0) 2(0.433,0)
R0603
  rect 0.806x0.864 smd: 1(-0.753,0) 2(0.753,0)
SOD-882_L1.0-W0.6-RD
  rect 0.4x0.7 smd: 1(-0.35,0) 2(0.35,0)
SOT-23-3_L3.0-W1.7-P0.95-LS2.9-BR
  rect 1.038x0.532 smd: 1(1.101,-0.95) 2(1.101,0.95) 3(-1.101,0)
USB-C-SMD_TYPE-C-16P-USB4110-GF-A
  rect 2.18x2 smd: 8(-5.11,1.677) 9(5.11,1.677) 10(-5.11,-2.252) 11(5.11,-2.252)
  rect 0.6x1.15 smd: A1B12(-3.2,2.252) A4B9(-2.4,2.252) B1A12(3.2,2.252) B4A9(2.4,2.252)
  rect 0.3x1.15 smd: A5(-1.25,2.252) A6(-0.25,2.252) A7(0.25,2.252) A8(1.25,2.252) B5(1.75,2.252) B6(0.75,2.252) B7(-0.75,2.252) B8(-1.75,2.252)
WIFIM-SMD_ESP32-C3-MINI-1
  rect 0.8x0.4 smd: 1(-5.9,4) 2(-5.9,3.2) 3(-5.9,2.4) 4(-5.9,1.6) 5(-5.9,0.8) 6(-5.9,0) 7(-5.9,-0.8) 8(-5.9,-1.6) 9(-5.9,-2.4) 10(-5.9,-3.2) 11(-5.9,-4) 25(5.9,-4) 26(5.9,-3.2) 27(5.9,-2.4) 28(5.9,-1.6) 29(5.9,-0.8) 30(5.9,0) 31(5.9,0.8) 32(5.9,1.6) 33(5.9,2.4) 34(5.9,3.2) 35(5.9,4)
  rect 0.4x0.8 smd: 12(-4.8,-4.9) 13(-4,-4.9) 14(-3.2,-4.9) 15(-2.4,-4.9) 16(-1.6,-4.9) 17(-0.8,-4.9) 18(0,-4.9) 19(0.8,-4.9) 20(1.6,-4.9) 21(2.4,-4.9) 22(3.2,-4.9) 23(4,-4.9) 24(4.8,-4.9) 36(4.8,4.9) 37(4,4.9) 38(3.2,4.9) 39(2.4,4.9) 40(1.6,4.9) 41(0.8,4.9) 42(0,4.9) 43(-0.8,4.9) 44(-1.6,4.9) 45(-2.4,4.9) 46(-3.2,4.9) 47(-4,4.9) 48(-4.8,4.9)
  custom 1.45x1.45 smd: 49(-1.975,1.975)
  rect 1.45x1.45 smd: 49(-1.975,0) 49(-1.975,-1.975) 49(0,1.975) 49(0,0) 49(0,-1.975) 49(1.975,1.975) 49(1.975,0) 49(1.975,-1.975)
  rect 0.7x0.7 smd: 50(5.95,4.95) 51(5.95,-4.95) 52(-5.95,-4.95) 53(-5.95,4.95)

## Nets
As in the schematic.

Pads without a net: U1 4 7 9 10 15 17 24 25 28 29 32 33 34 35; U2 2 3 4 9 10 11; USB1 A8 B8

## Via types
v1: diameter 0.61, hole 0.305, Top Layer to Bottom Layer, 42 vias
v2: diameter 1.219, hole 0.61, Top Layer to Bottom Layer, 4 vias

## Routing (per net, layer and track width the routed paths; a pad name or vN(x,y) marks a point on that pad's centre or on a via; arc(x,y) is an arc through that point)
3V3: length 77.2
  Top Layer w0.254: 38.81,39.31 38.81,39.15 39.41,38.55 39.41,37.07 39.25,36.91 38.91,36.91 U2.8 38.86,36.76 38.97,36.76 39.66,36.08 40,36.08 40.16,35.91 40.16,35.14 40,34.98 39.26,34.98 38.95,35.29 38.95,35.36 38.83,35.49 ; 38.81,39.31 U2.12 38.06,37.56 37.66,37.16 37.32,37.16 37.16,37 37.16,36.66 U2.5 ; 38.81,39.31 38.81,39.39 R14.1 39.26,39.34 v1(39.84,39.34) ; 38.83,35.49 v1(38.83,34.14) ; 38.83,35.49 C2.2 37.72,35.53 C3.2 ; H1.15 v1(45.81,45.69) ; v1(36.03,40.61) 36.11,40.53 36.8,40.53 ; v1(34.51,28.92) 34.51,30.06 R13.2 41.07,30.07 v1(42.64,31.64) ; v1(27.91,30.32) 27.91,30.91 27.84,30.98 27.64,30.98 27.48,31.14 27.48,31.34 U1.3 ; v1(36.67,22.45) 36.67,22.95 37.25,23.53 C9.2 39.71,23.53 C8.2 41.85,22.77 42,22.61 42.73,22.61 43.09,22.25
  Bottom Layer w0.254: v1(45.81,45.69) 45.81,44.81 45.65,44.65 45.65,36.05 45.81,35.89 45.81,35.02 45.47,34.67 45.47,33.51 44.78,32.82 43.83,32.82 v1(42.64,31.64) 42.31,31.97 39.59,31.97 38.83,32.73 v1(38.83,34.14) ; v1(36.03,40.61) 38.57,40.61 v1(39.84,39.34) ; v1(36.67,22.45) 34.51,24.61 v1(34.51,28.92) 33.11,30.32 v1(27.91,30.32)
GND: length 292.8
  Top Layer w0.254: 39.46,20.35 C9.1 ; 39.46,20.35 C8.1 41.85,21.36 42,21.52 42.58,21.52 43.28,20.82 43.28,20.58 43.44,20.41 43.69,20.41 D5.2 44.13,20.41 44.37,20.41 45.18,21.22 45.18,21.52 46.55,21.52 C5.1 47.84,21.36 C6.1 ; 39.46,20.35 39.79,20.35 v1(40.1,20.03) ; Q2.2 53.51,27.37 R6.1 ; C2.1 39.32,35.84 39.32,35.91 38.83,36.41 38.37,36.41 38.21,36.56 U2.7 U2.6 37.56,36.2 37.31,35.95 37.23,35.95 37.07,35.79 37.07,35.71 C3.1 ; v1(35.78,45.43) 35.16,46.06 R12.2 35.13,46.4 R9.2 33.55,46.67 32.84,47.39 32.84,49.95 32.46,50.32 ; R7.1 22.39,27.37 Q3.2 22.6,26.85 23.4,26.05 26.52,26.05 30.41,29.94 ; R8.1 23.01,47.47 Q4.2 ; v1(43.53,23.84) 43.53,22.32 43.46,22.25 ; 48.99,48.81 50.04,48.81 Q1.2 ; U1.51 v1(35.78,43.51) ; U1.49 U1.49 ; U1.49 U1.49 ; U1.49 U1.49 ; U1.49 U1.49 ; U1.49 U1.49 32.76,34.36 ; U1.49 U1.49 ; U1.50 U1.53 26.31,31.61 U1.2 ; U1.49 U1.49 ; U1.49 U1.42 ; U1.49 U1.49 ; U1.52 33.61,31.61 U1.11 33.56,33.56 32.76,34.36 ; 32.76,34.36 U1.14 35.59,34.36 36.76,35.53 35.88,36.41 35.87,36.41 35.7,36.57 35.7,38.05 35.87,38.21 36.21,38.21 U2.1
  Top Layer w0.508: 41.34,50.32 USB1.8 ; 41.34,50.32 44.29,47.38 H1.16 ; 41.34,50.32 USB1.A1B12 ; 56.74,26.14 56.48,25.89 54.08,25.89 53.12,26.85 Q2.2 ; 32.46,50.32 33.79,50.32 USB1.B1A12
  Top Layer w0.762: 52.61,44.99 51.62,44 51.62,38.19 CN5.2 ; 52.61,44.99 55.52,42.07 CN5.3 ; 52.61,44.99 55.91,48.29 ; Q1.2 55.91,48.29 ; 55.91,48.29 56.99,49.37 56.99,52.74 CN1.3 ; 32.46,54.25 29.98,56.74 29.43,56.74 28.94,57.23 CN4.3 ; 32.46,54.25 32.46,50.32 ; 32.46,54.25 USB1.10 USB1.8 ; Q4.2 21.87,49.54 18.98,49.54
  Top Layer w1.016: 53.6,18.51 CN2.3 ; 53.6,18.51 48.96,18.51 ; 53.6,18.51 56.74,21.64 56.74,30.45 55.52,31.66 CN5.4 CN5.3 ; U1.50 20.51,43.51 18.98,45.04 ; 18.98,21.04 CN3.3 ; 18.98,21.04 21.52,18.51 35.51,18.51 arc(37.56,18.54) 39.61,18.51 48.96,18.51 ; 18.98,21.04 18.98,23.96 ; 48.96,18.51 48.96,20.24 C6.1 ; 18.98,45.04 18.98,23.96 ; 18.98,45.04 18.98,54.08 CN4.3 ; 18.98,23.96 Q3.2 ; CN1.3 CN1.4
  Bottom Layer w0.254: v1(43.53,23.84) 43.53,23.46 v1(40.1,20.03) ; v1(35.78,43.51) v1(35.78,45.43)
VBAT: length 117.5
  Top Layer w0.508: 23.36,52.79 D4.1 ; 23.36,52.79 22.42,53.73 ; 23.36,52.79 26.76,52.79 v2(28.29,54.32) ; CN3.2 23.06,21.39 D3.1 24.48,22.55 25.13,22.55 25.7,21.99 34.7,21.99 38.97,26.26 44.04,26.26 46.7,28.92 ; D1.1 49.06,53.4 49.06,54.91 49.24,55.08 50.89,55.08 52.25,53.73 CN1.2 ; 50.88,25.35 D2.1 50.88,23.36 CN2.1
  Top Layer w0.762: D1.1 46.7,53.31 ; 46.7,53.31 44.3,50.91 44.3,49.1 45.27,48.14 47.94,48.14 49.75,46.32 v2(49.75,40.61) ; 46.7,53.31 46.7,54.7 v2(45.69,55.72) ; 50.89,25.37 51.4,25.88 51.4,31.12 ; 51.4,31.12 v2(51.4,33.24) ; 51.4,31.12 49.06,31.12 ; 49.06,31.12 49.06,33.37 CN5.1 ; 49.06,31.12 49.06,29.46 48.52,28.92 H1.1 ; CN4.1 22.42,53.73
  Bottom Layer w0.762: v2(45.69,55.72) 29.69,55.72 v2(28.29,54.32) ; v2(51.4,33.24) 49.75,34.89 v2(49.75,40.61)
VCC: length 58.9
  Top Layer w0.254: USB1.B4A9 35.39,49.97 35.39,50.83 36.36,51.8 36.36,52.29 36.71,52.64 38.36,52.64 39.85,51.14 39.85,50.57 39.97,50.46 USB1.A4B9 40.19,49.53 40.19,49.06 40.35,48.9 40.82,48.9 42.64,47.08 v1(42.64,46.83) 43.11,46.36 43.11,46.21 43.8,45.52 44.78,45.52 44.88,45.62 45.05,45.62 45.57,45.1 46.06,45.1 46.29,45.34 47.32,45.34 48.01,44.65 48.01,44.11 v1(48.72,43.4) ; v1(45.81,26.38) 46.01,26.38 C6.2 48.1,22.77 C5.2 46.55,22.61 45.18,22.61 44.45,21.88 43.89,21.88 ; H1.2 44.29,28.41 v1(43.15,27.27) ; 43.89,21.88 43.89,20.91 D5.1 ; 43.89,21.88 43.1,21.88
  Bottom Layer w0.254: v1(48.72,43.4) 48.72,35.45 48.15,34.88 48.15,34.4 48.37,34.18 48.37,28.26 47.49,27.39 44.21,27.39 43.62,26.8 ; 43.62,26.8 v1(43.15,27.27) ; 43.62,26.8 44.04,26.38 v1(45.81,26.38)
DN: length 8.7
  Top Layer w0.254: R10.2 38.33,45.77 37.75,45.19 37.75,44.77 37.34,44.35 33.14,44.35 32.74,44.74 32.56,44.56 32.56,44.31 32.76,44.11 32.76,43.46
DP: length 8.7
  Top Layer w0.254: R11.2 36.77,45.77 37.35,45.2 37.35,44.93 37.17,44.75 33.3,44.75 32.91,45.15 32.57,45.15 32.16,44.73 32.16,44.31 31.96,44.11 U1.27
I2C_SCL/IO9: length 14.2
  Top Layer w0.254: U2.13 37.66,38.66 37.66,39 38.14,39.49 R14.2 ; U1.23 34.78,41.24 37.04,41.24 38.14,40.13 R14.2 ; R14.2 38.45,39.89 38.45,39.98 38.61,40.14 40.27,40.14 H1.14
I2C_SDA/IO8: length 26.4
  Top Layer w0.254: v1(32.99,40.73) 34.43,40.73 U1.22 34.48,40.73 35.01,40.73 36.08,39.67 R15.2 37.06,39.4 U2.14 ; v1(42.26,38.58) 43.11,39.43 43.11,39.57 43.85,40.31 v1(46.23,40.31) ; v1(47.59,42.89) 47.59,43.4 H1.13
  Bottom Layer w0.254: v1(46.23,40.31) 47.18,40.31 48.01,41.13 48.01,42.11 47.59,42.53 v1(47.59,42.89) ; v1(42.26,38.58) 39.64,41.19 35.79,41.19 35.34,40.73 v1(32.99,40.73)
IO5: length 17.3
  Top Layer w0.254: U1.19 34.42,38.32 v1(32.99,38.32) ; v1(41.12,38.45) H1.12
  Bottom Layer w0.254: v1(41.12,38.45) 40.99,38.32 40.99,36.48 40.36,35.86 39.58,35.86 37.12,38.32 v1(32.99,38.32)
IO6: length 21.9
  Top Layer w0.254: v1(40.1,38.32) 40.1,38.45 43.11,41.46 43.11,42.11 43.8,42.8 44.78,42.8 45.96,41.62 H1.11 ; v1(32.99,39.08) 34.38,39.08 U1.20
  Bottom Layer w0.254: v1(32.99,39.08) 36.86,39.08 39.73,36.21 40.21,36.21 40.56,36.55 40.56,37.04 40.1,37.5 v1(40.1,38.32)
IO7: length 17.6
  Top Layer w0.254: U1.21 34.44,39.97 v1(32.99,39.97) ; v1(39.97,36.8) 40.99,37.81 45.56,37.81 H1.9
  Bottom Layer w0.254: v1(39.97,36.8) 36.8,39.97 v1(32.99,39.97)
IO10: length 17.3
  Top Layer w0.254: v1(33.11,36.72) 33.7,36.72 33.78,36.64 33.78,36.44 34.26,35.96 U1.16 ; v1(42.38,35.53) 42.38,36.29 v1(41.62,37.05)
  Bottom Layer w0.254: v1(42.38,35.53) 41.93,35.07 39.36,35.07 37.71,36.72 v1(33.11,36.72) ; H1.10 43.66,39.08 v1(41.62,37.05)
MOTOR1: length 32.1
  Top Layer w0.254: v1(47.72,50.13) 47.72,51.2 R1.1 ; U1.12 34.78,33.08 43.55,33.08 43.8,32.82 44.78,32.82 44.79,32.83 45.15,32.83 46.51,34.19 46.64,34.19 H1.5
  Bottom Layer w0.254: H1.5 47.34,34.51 47.34,34.88 48.36,35.9 48.36,42.93 48.14,43.16 48.14,43.64 48.52,44.02 48.52,47.19 47.34,48.37 47.34,49.24 47.72,49.62 v1(47.72,50.13)
MOTOR2: length 26.6
  Top Layer w0.254: v1(48.73,34.64) 48.01,35.36 48.01,37.03 47.32,37.72 46.34,37.72 45.65,37.03 45.65,35.36 H1.6 43.85,33.56 U1.13 ; v1(53.56,31.08) 53.56,30.12 R2.1
  Bottom Layer w0.254: v1(53.56,31.08) 52.29,31.08 v1(48.73,34.64)
MOTOR3: length 37.6
  Top Layer w0.254: R3.1 22.7,29.73 22.7,29.82 22.86,29.98 23.66,29.98 24.21,29.43 27.65,29.43 ; 27.65,29.43 28.41,29.43 29.56,30.57 U1.6 ; 27.65,29.43 v1(27.65,28.67) ; H1.7 46.83,35.67 48.01,34.49 48.01,33.51 47.32,32.82 46.15,32.82 45.47,32.14 45.47,30.97 44.78,30.28 43.8,30.28 42.31,28.8 35.21,28.8 34.75,28.34 34.27,28.34 33.81,28.8 30.57,28.8 v1(29.69,27.91)
  Bottom Layer w0.254: v1(27.65,28.67) 28.92,28.67 v1(29.69,27.91)
MOTOR4: length 29.3
  Top Layer w0.254: R4.1 25.62,45.69 v1(26.38,44.92) ; U1.18 v1(32.99,37.56)
  Bottom Layer w0.254: H1.8 43.27,37.56 43.27,37.56 41.14,35.42 39.51,35.42 37.38,37.56 v1(32.99,37.56) 32.92,37.56 32.4,38.08 32.4,38.91 v1(26.38,44.92)
RXD: length 42.5
  Top Layer w0.254: U1.30 29.56,41.11 v1(29.43,40.99) ; v1(42.64,32.46) 41.61,32.46 v1(39.97,30.83)
  Bottom Layer w0.254: 38.25,34.38 34.51,34.38 29.43,39.46 v1(29.43,40.99) ; 38.25,34.38 38.59,34.73 39.07,34.73 39.41,34.38 42,34.38 42.18,34.2 42.18,32.68 42.4,32.46 v1(42.64,32.46) ; H1.4 45.47,32.64 47.32,32.64 48.01,31.95 48.01,30.97 47.17,30.14 45.53,30.14 45.47,30.08 45.47,28.43 44.78,27.74 43.8,27.74 43.11,28.43 43.11,29.34 41.34,31.11 40.25,31.11 v1(39.97,30.83)
TXD: length 26.9
  Top Layer w0.254: 28.76,43.46 28.67,43.37 v1(28.67,41.37)
  Bottom Layer w0.254: v1(28.67,41.37) 28.67,39.32 36.38,31.61 41.84,31.61 43.55,29.9 43.6,29.9 43.8,30.1 44.72,30.1 45.7,31.08 46.45,31.08 H1.3
$1N2473: length 3.5
  Top Layer w0.254: Q1.1 50.04,49.68 R5.2 48.99,50.95 R1.2
$1N2475: length 9
  Top Layer w0.508: 53.73,52.84 52.67,51.78 51.29,51.78 D1.2
  Top Layer w0.762: Q1.3 53.73,50.22 CN1.1
$1N2480: length 3.4
  Top Layer w0.254: Q2.1 55.02,28.02 R6.2 R2.2
$1N2482: length 5.4
  Top Layer w0.508: D2.2 53.14,23.84 Q2.3
  Top Layer w0.762: Q2.3 54.07,22.61 CN2.2
$1N2487: length 2.8
  Top Layer w0.254: R3.2 R7.2 23.78,27.64 Q3.1
$1N2489: length 5
  Top Layer w0.508: D3.2 23.19,24.65 Q3.3
  Top Layer w0.762: CN3.1 22.83,23.71 Q3.3
$1N2494: length 2.9
  Top Layer w0.254: R4.2 R8.2 21.63,47.88 Q4.1
$1N2496: length 4.8
  Top Layer w0.762: CN4.2 22.06,52.17 Q4.3 23.44,50.6 D4.2
$1N2513: length 10
  Top Layer w0.254: R9.1 33.55,48.74 v1(33.42,48.87) ; USB1.A5 38.89,49.82 38.89,51.31 37.92,52.28 37.18,52.28 v1(36.94,52.04)
  Bottom Layer w0.254: v1(33.42,48.87) 34.77,50.22 34.93,50.22 35.28,50.57 35.28,50.69 36.64,52.04 v1(36.94,52.04)
$1N2515: length 4.3
  Top Layer w0.254: R10.1 38.32,47.94 USB1.B7 38.25,49.68 38.25,49.06 38.08,48.9 37.55,48.9 37.39,49.06 37.39,49.6 37.34,49.65 37.34,49.73 USB1.A7
$1N2516: length 4.3
  Top Layer w0.254: USB1.A6 37.75,49.82 37.75,50.44 37.58,50.6 37.05,50.6 36.89,50.44 36.89,49.82 USB1.B6 36.82,47.99 R11.1
$1N2522: length 2.1
  Top Layer w0.254: R12.1 35.16,48.47 35.75,49.06 35.75,49.68 USB1.B5
$1N2536: length 4.4
  Top Layer w0.254: U1.8 31.48,31.34 31.48,31.14 32.56,30.07 R13.1 32.87,29.94 C1.1
